# Altium schematic sheet [04] - Power.SchDoc: =ProjectName
size A4; CheckedBy: DatNB; Author: Ven; CompanyName: Nacentech; Organization: IMET
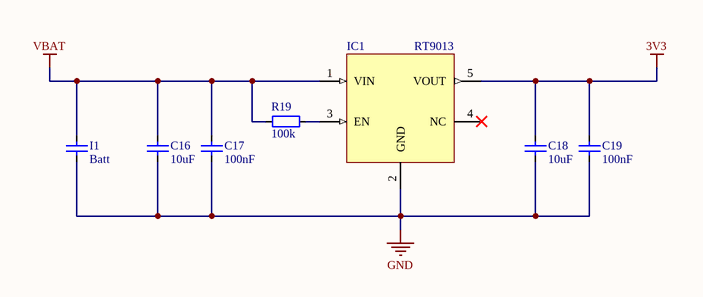
[diagram p0: [04] - Power.SchDoc]

## Parts
C16  10uF  [CAP_0603]
C17  100nF  [CAP_0603]
C18  10uF  [CAP_0603]
C19  100nF  [CAP_0603]
I1  Batt  [CAP_3216]
IC1  RT9013  [SOT23-5]
R19  100k  [RES-SMD-0603]

## Nets
3V3: C18.2 C19.2 IC1.5(VOUT)
GND: C16.1 C17.1 C18.1 C19.1 I1.1 IC1.2(GND)
VBAT: C16.2 C17.2 I1.2 IC1.1(VIN) R19.2
NetIC1_3: IC1.3(EN) R19.1

Not connected (* = marked no-connect by the designer): IC1 4(NC)*

## Notes on the sheet
- Project:
- Page Contents:
- Size:
- Date:
- A4
- Checked by:
- Time:
- Revision:
- Sheet
- of
- File:

## Library data of the parts
C16-C19 = CapSMD: Capacitor; Value: 33p; Published: 8-Jun-2000; LatestRevisionDate: 17-Jul-2002; LatestRevisionNote: Re-released for DXP Platform.; PackageReference: RAD-0.3; Publisher: Altium Limited
I1 = CapSMD: Pad; Value: 33p; Published: 8-Jun-2000; LatestRevisionDate: 17-Jul-2002; LatestRevisionNote: Re-released for DXP Platform.; PackageReference: RAD-0.3; Publisher: Altium Limited
IC1 = RT9013: RT9013-33GB IC REG LINEAR 3.3V 500mA SOT23-5
R19 = Resistor - SMD: Resistor; Manufacturer: Generic Components; Class: Passive; Published: 08/06/2000; Publisher: Altium Hobart Technology Centre